# EAGLE design LEDPanel_Dimmer (EAGLE 9.3.2)
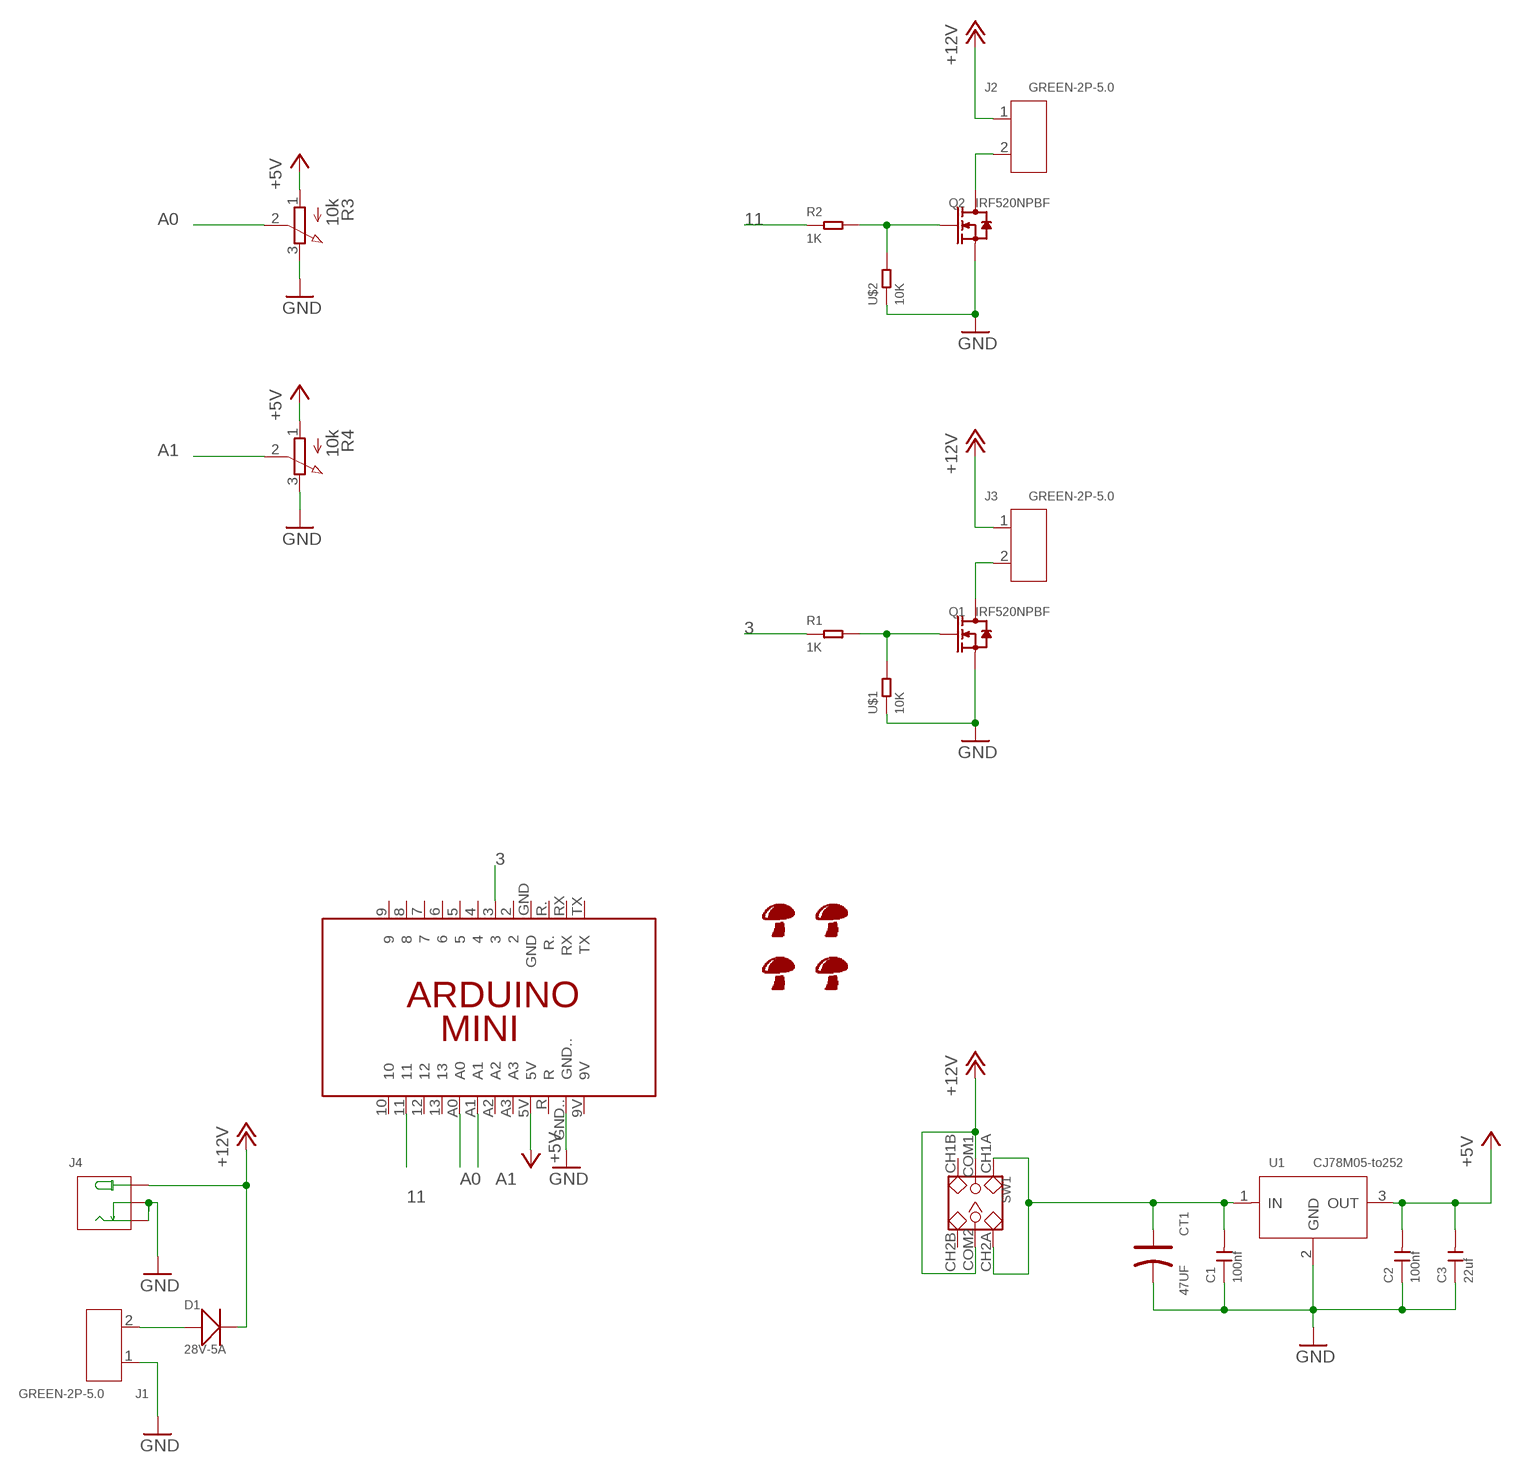
[diagram p0: schematic, sheet 1]

## Parts
C1  100nf  CERAMIC-100NF-50V-10%-X7R(0805)  [C0805]
C2  100nf  CERAMIC-100NF-50V-10%-X7R(0805)  [C0805]
C3  22uf  CERAMIC-22UF-6.3V-20%-X5R(0805)  [C0805]
CT1  47UF  ALUMINUM-SMD-47UF-25V(D6.3-H5.3MM)  [ELECTRO-SMD-C-6MM]
D1  28V-5A  SMD-DIODE-SCHOTTKY-28V-5A(DO-214AA)  [DO-214AA]
J1  GREEN-2P-5.0  SCREW-TERMINAL-GREEN(2P-5.0)  [H2-5.0-10.5X8.0MM]
J2  GREEN-2P-5.0  SCREW-TERMINAL-GREEN(2P-5.0)  [H2-5.0-10.5X8.0MM]
J3  GREEN-2P-5.0  SCREW-TERMINAL-GREEN(2P-5.0)  [H2-5.0-10.5X8.0MM]
J4  JACK-DC-005'DC-005'  [3P-L14.2*W11.0*H9.0MM]
Q1  IRF520NPBF  DIP-MOSFET-N-CH-100V-9.7A-IRF520NPBF(TO-220AB)  [TO-220]
Q2  IRF520NPBF  DIP-MOSFET-N-CH-100V-9.7A-IRF520NPBF(TO-220AB)  [TO-220]
R1  1K  SMD-RES-100R-1%-1/8W(0805)  [R0805]
R2  1K  SMD-RES-100R-1%-1/8W(0805)  [R0805]
R3  10k  3RP/1610N  [3RP/1610N]
R4  10k  3RP/1610N  [3RP/1610N]
SW1  DIP-TOGGLE-SWITCH-2CH-(2X3P-2.54)  [SW6-2.54-9.0X3.5X3.2+2.0MM]
U1  CJ78M05-to252  PMIC-CJ78M05(TO-252)  [TO-252]
U$1  10K  SMD-RES-10K-1%-1/8W(0805)  [R0805]
U$2  10K  SMD-RES-10K-1%-1/8W(0805)  [R0805]
U$3  ARDUINO_MINI_REDUCED  [ARDUINO_MINI_REDUCED]
U$4  SHROOMBOTTOMSILK  [SHROOM_BS]
U$5  SHROOMTOPSILK  [SHROOM_TS]
U$6  SHROOM10MM  [SHROOM10MM]
U$7  SHROOM5MM  [SHROOM]

## Nets
3: R1.1 U$3.3
11: R2.1 U$3.11
+5V: C2.2 C3.2 R3.1(A) R4.1(A) U1.3(OUT) U$3.5V
+12V: D1.- J2.1 J3.1 J4.+ SW1.COM1 SW1.COM2
A0: R3.2(S) U$3.A0
A1: R4.2(S) U$3.A1
GND: C1.1 C2.1 C3.1 CT1.- J1.1 J4.-1(-) J4.-2(CDN) Q1.3(S) Q2.3(S) R3.3(E) R4.3(E) U1.2(GND) U$1.1 U$2.1 U$3.GND..
N$1: D1.+ J1.2
N$2: C1.2 CT1.+ SW1.CH1A SW1.CH2A U1.1(IN)
N$3: Q1.1(G) R1.2 U$1.2
N$4: J3.2 Q1.2(D) Q1.HEAT(D)
N$6: Q2.1(G) R2.2 U$2.2
N$8: J2.2 Q2.2(D) Q2.HEAT(D)
Unconnected: SW1.CH1B SW1.CH2B U$3.2 U$3.4 U$3.5 U$3.6 U$3.7 U$3.8 U$3.9 U$3.9V U$3.10 U$3.12 U$3.13 U$3.A2 U$3.A3 U$3.GND U$3.R U$3.R. U$3.RX U$3.TX

## Library data of the parts
C1 C2 = OPL_Capacitor:CERAMIC-100NF-50V-10%-X7R(0805): 302010165; MPN: CC0805KRX7R9BB104
C3 = OPL_Capacitor:CERAMIC-22UF-6.3V-20%-X5R(0805): 302010171; MPN: CC0805MKX5R5BB226
CT1 = OPL_Capacitor:ALUMINUM-SMD-47UF-25V(D6.3-H5.3MM): 302030059; MPN: CS1E470M-CRE54
D1 = OPL_Discrete_Semiconductor:SMD-DIODE-SCHOTTKY-28V-5A(DO-214AA): 304020021; MPN: SS54B
J1-J3 = OPL_Connector:SCREW-TERMINAL-GREEN(2P-5.0): 320110031
J4 = OPL_Connector:JACK-DC-005: 320120003
Q1 Q2 = OPL_Discrete_Semiconductor:DIP-MOSFET-N-CH-100V-9.7A-IRF520NPBF(TO-220AB): 305030059; MPN: IRF520NPBF
R1 R2 = OPL_Resistor:SMD-RES-100R-1%-1/8W(0805): 301012151; MPN: RC0805JR-071KL
R3 R4 = pot:3RP/1610N: 16mm Potentiometer one level Source: http://www.alphapotentiometers.net/html/16mm_pot_2.html
SW1 = OPL_Switch:DIP-TOGGLE-SWITCH-2CH-(2X3P-2.54): 311010004; MPN: MS-22D18 G2 ROHS
U1 = OPL_IC:PMIC-CJ78M05(TO-252): 310030100; MPN: CJ78M05
U$1 U$2 = OPL_Resistor:SMD-RES-10K-1%-1/8W(0805): 301012152; MPN: RC0805FR-0710KL
U$3 = RobThePyro:ARDUINO_MINI_REDUCED
U$4-U$7 = RobThePyro:SHROOM

## Board
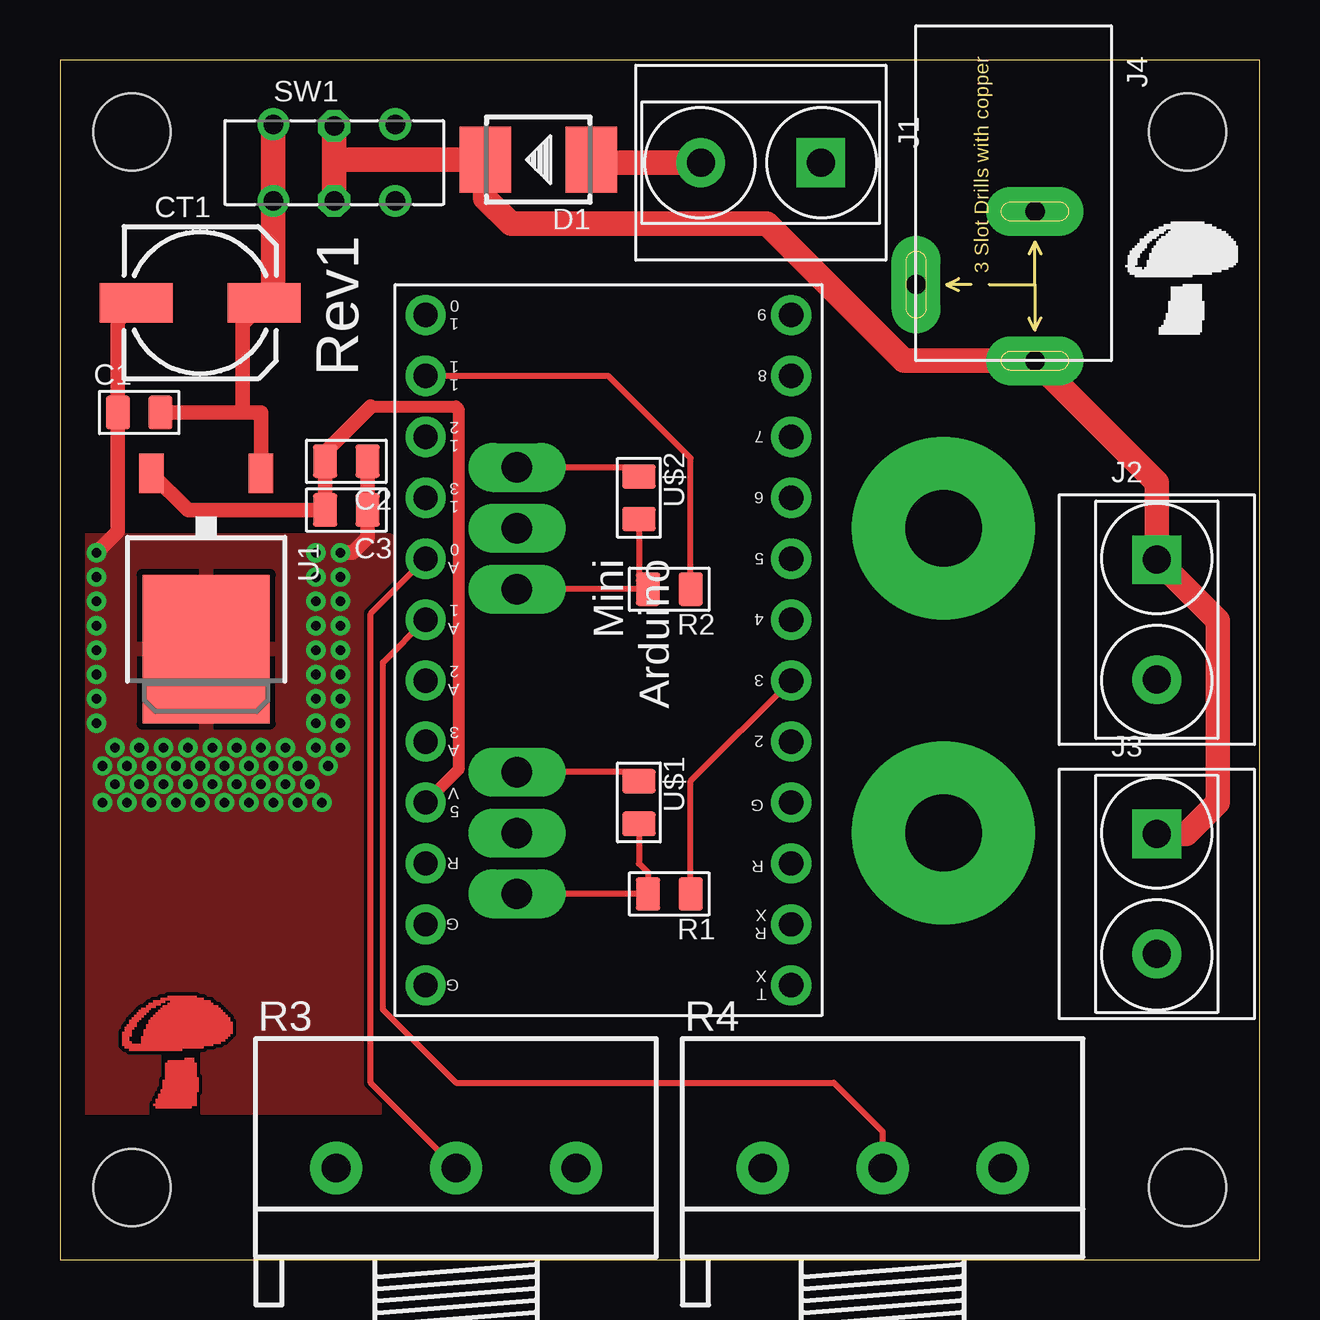
[diagram p1: board, top side]
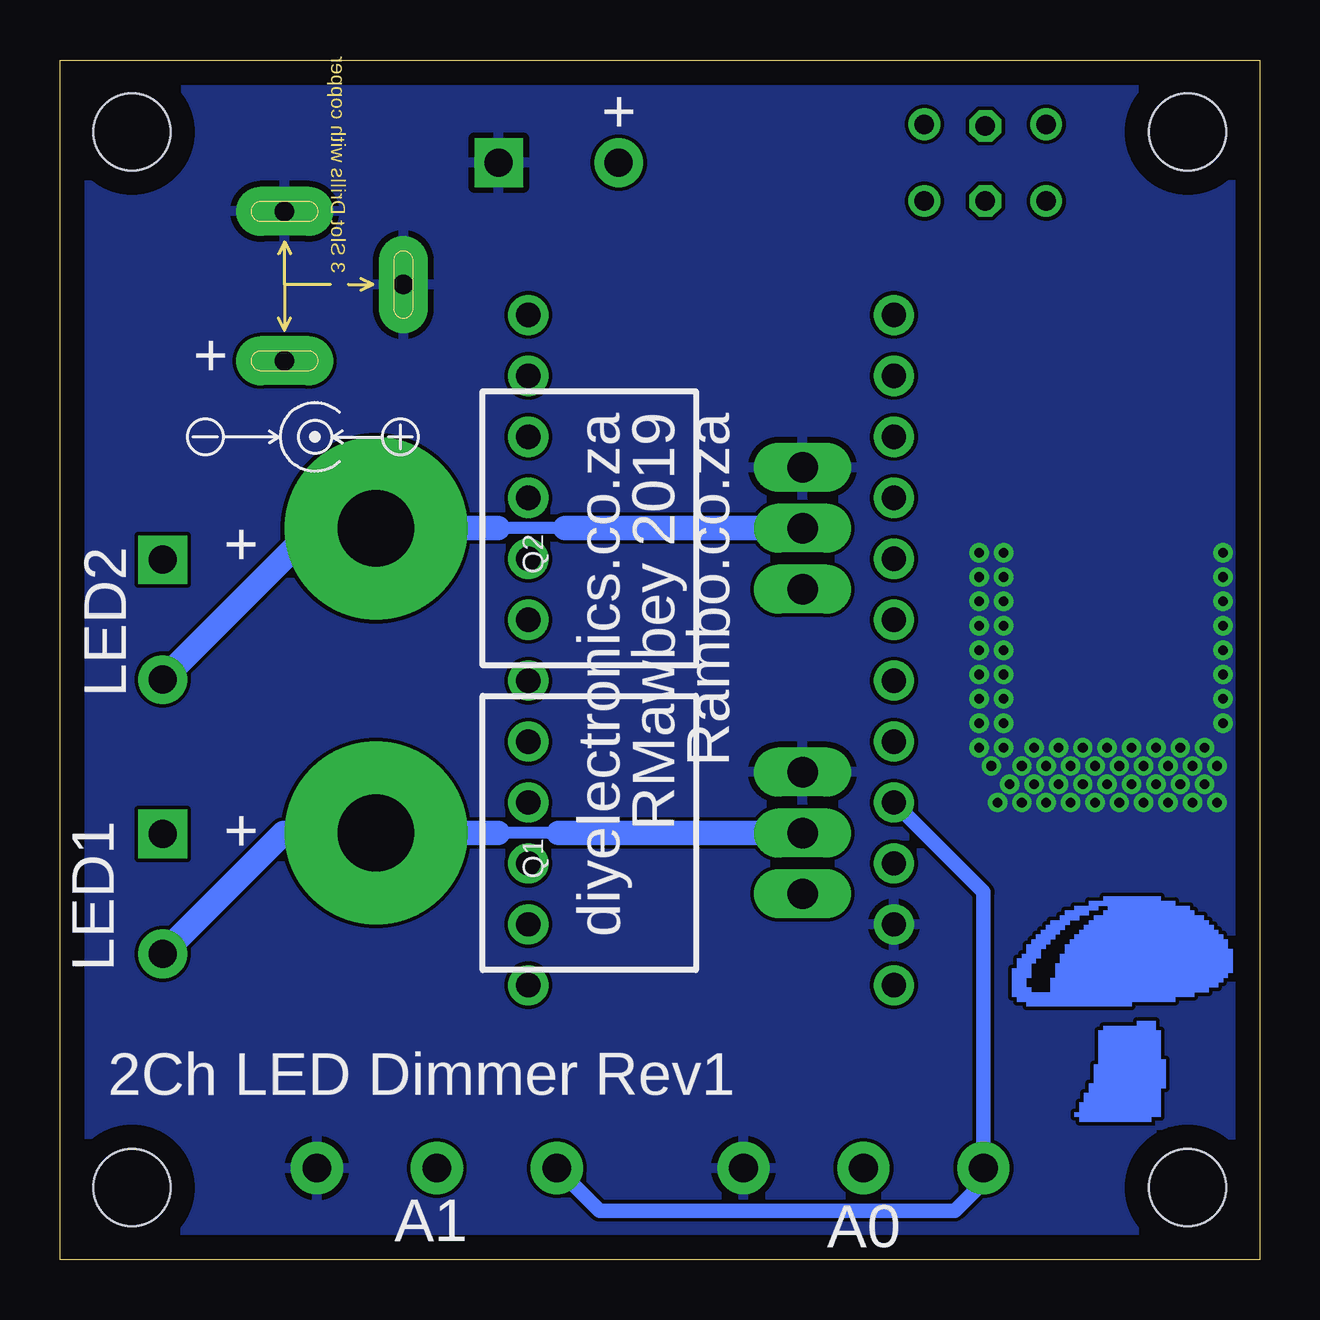
[diagram p2: board, bottom side, seen from below]

Size 50 x 50 mm. Coordinates in mm from the lower left corner, seen from the top.
Outline: 0,0 50,0 50,50 0,50 0,0
Copper layers (1*16): Top 0.035mm / dielectric 1.5mm / Bottom 0.035mm
Design rules "default": minimum track width 6mil, minimum drill 0.35mm, track to track 6mil, track to pad 6mil, pad to pad 6mil, via to via 6mil, smd to smd 6mil, copper to edge 40mil, drill to drill 6mil, minimum pad ring 10mil, minimum via ring 8mil, stop-mask expansion 4mil, vias tented up to drill 0mil, thermal gap 10mil
Holes 3.2 mm at 3,3 47,3 47,47 3,47

### Footprints (pad centres in the part's own frame; a part is rotated, then mirrored left to right if it is on the bottom)
C0805 = smd 1.397 x 1.016: 1 0,0.889; 2 0,-0.889
ELECTRO-SMD-C-6MM = smd 3.048 x 1.651: + 2.667,0; - -2.667,0
DO-214AA = smd 2.159 x 2.743: + -2.21,0; - 2.21,0
H2-5.0-10.5X8.0MM = drill 1.168 pad 2.032 square: 1 0,2.5 | drill 1.168 pad 2.032: 2 0,-2.5
3P-L14.2*W11.0*H9.0MM = drill 0.813 pad 2.032 long: + 3.175,0; -1 -3.048,0; -2 0,-4.953
TO-220 = drill 1.27 pad 2.032 long: 1 -2.54,-11.43; 2 0,-11.43; 3 2.54,-11.43 | drill 3.2 pad 7.62: HEAT 0,6.35
R0805 = smd 1.397 x 1.016: 1 0,0.889; 2 0,-0.889
3RP/1610N = drill 1.2 pad 2.184: 1 -5,0; 2 0,0; 3 5,0
SW6-2.54-9.0X3.5X3.2+2.0MM = drill 0.813 pad 1.27: CH1A -2.54,-1.6; CH1B 2.54,-1.6; CH2A -2.54,1.6; CH2B 2.54,1.6 | drill 0.813 pad 1.27 octagon: COM1 0,-1.6; COM2 0,1.524
TO-252 = smd 1.016 x 1.651: 1 -2.286,-4.826; 3 2.286,-4.826 | smd 5.3 x 6.2: 2 0,2.5
ARDUINO_MINI_REDUCED = drill 1.016 pad 1.676: 2 19.05,16.51; 3 16.51,16.51; 4 13.97,16.51; 5 11.43,16.51; 5V 21.59,1.27; 6 8.89,16.51; 7 6.35,16.51; 8 3.81,16.51; 9 1.27,16.51; 9V 29.21,1.27; 10 1.27,1.27; 11 3.81,1.27; 12 6.35,1.27; 13 8.89,1.27; A0 11.43,1.27; A1 13.97,1.27; A2 16.51,1.27; A3 19.05,1.27; GND 21.59,16.51; GND.. 26.67,1.27; R 24.13,1.27; R. 24.13,16.51; RX 26.67,16.51; TX 29.21,16.51

### Placement (x,y rotation side)
C1  3.3,35.31 90 top
C2  11.94,33.27 270 top
C3  11.94,31.24 270 top
CT1  5.84,39.88 0 top
D1  19.94,45.85 180 top
J1  29.21,45.72 270 top
J2  45.72,26.67 0 top
J3  45.72,15.24 0 top
J4  40.64,40.64 270 top
Q1  30.48,17.78 90 bottom
Q2  30.48,30.48 90 bottom
R1  25.4,15.24 270 top
R2  25.4,27.94 270 top
R3  16.51,3.81 0 top
R4  34.29,3.81 0 top
SW1  11.43,45.72 0 top
U1  6.1,27.94 180 top
U$1  24.13,19.05 0 top
U$2  24.13,31.75 0 top
U$3  13.97,40.64 270 top
U$4  44.45,38.61 0 top
U$5  44.45,38.61 0 top
U$6  10.41,5.84 0 bottom
U$7  2.54,6.35 0 top

### Tracks (layer width: path | path; a pad name or v marks a point on that pad's centre or on a via)
3
  Top 0.254: U$3.3 26.29,19.94 R1.1
11
  Top 0.254: R2.1 26.29,33.4 22.86,36.83 U$3.11
+5V
  Top 0.508: 12.95,35.56 16.51,35.56 16.61,35.46 16.61,20.42 U$3.5V
  Top 0.61: U1.3 5.33,31.24 C3.2 C2.2 11.05,33.66 12.95,35.56
  Bottom 0.61: U$3.5V 11.51,15.32 R3.1 11.51,3.22 12.7,2.03 27.51,2.03 R4.1
+12V
  Top 1.016: 11.43,45.72 SW1.COM2 | 11.43,45.72 11.56,45.85 D1.- 17.73,44.25 18.8,43.18 29.46,43.18 35.18,37.47 J4.+ 45.72,32.38 J2.1 48.26,26.63 48.26,19.05 46.95,17.74 J3.1 | 11.43,45.72 SW1.COM1
A0
  Top 0.254: R3.2 12.95,7.37 12.95,26.92 U$3.A0
A1
  Top 0.254: R4.2 34.29,5.33 32.26,7.37 16.51,7.37 13.46,10.41 13.46,24.89 U$3.A1
GND  (via drill 0.4)
  Top 0.254: U$1.1 23.75,20.32 Q1.3 | U$2.1 23.75,33.02 Q2.3
  Top 0.61: CT1.- 2.41,39.12 C1.1 2.41,30.35 v1.52,29.46 | C2.1 C3.1 12.83,30.1 12.19,29.46 v11.68,29.46
  other vias: 5.33,21.34 6.35,21.34 7.37,21.34 8.38,21.34 9.4,21.34 4.32,21.34 3.3,21.34 2.29,21.34 1.52,22.35 1.52,23.37 1.52,24.38 1.52,25.4 1.52,26.42 1.52,27.43 1.52,28.45 10.67,22.35 10.67,23.37 10.67,24.38 10.67,25.4 10.67,26.42 10.67,27.43 10.67,28.45 10.67,29.46 10.67,21.34 11.68,21.34 11.68,22.35 11.68,23.37 11.68,24.38 11.68,25.4 11.68,26.42 11.68,27.43 11.68,28.45 2.79,20.57 3.81,20.57 4.83,20.57 5.84,20.57 6.86,20.57 7.87,20.57 8.89,20.57 9.91,20.57 1.78,20.57 2.29,19.81 3.3,19.81 4.32,19.81 5.33,19.81 6.35,19.81 7.37,19.81 8.38,19.81 9.4,19.81 10.41,19.81 11.18,20.57 2.79,19.05 1.78,19.05 3.81,19.05 4.83,19.05 5.84,19.05 6.86,19.05 7.87,19.05 8.89,19.05 9.91,19.05 10.92,19.05
  pour Bottom: 0,0 50,0 50,50 0,50
  pour Top: 1.27,29.97 11.68,29.97 13.72,29.97 13.72,6.35 0,6.35 0,29.97
N$1
  Top 1.016: J1.2 22.28,45.72 D1.+
N$2
  Top 0.61: U1.1 8.38,35.31 7.62,35.31 | 7.62,35.31 7.62,38.99 CT1.+ | C1.2 7.62,35.31
  Top 1.016: SW1.CH2A SW1.CH1A 8.89,40.26 CT1.+
N$3
  Top 0.254: Q1.1 R1.2 24.51,16.13 24.13,16.51 U$1.2
N$4
  Bottom 0.508: 29.21,17.78 31.75,17.78
  Bottom 1.016: Q1.2 29.21,17.78 | 31.75,17.78 Q1.HEAT 40.68,17.78 J3.2
N$6
  Top 0.254: Q2.1 R2.2 24.13,28.32 U$2.2
N$8
  Bottom 0.508: 28.96,30.48 31.75,30.48
  Bottom 1.016: Q2.2 28.96,30.48 | 31.75,30.48 Q2.HEAT 39.41,30.48 J2.2

### Text on the board
tNames: Rev1
bNames: + | + | Rambo.co.za | RMawbey 2019 | diyelectronics.co.za | LED2 | + | LED1 | + | 2Ch LED Dimmer Rev1 | A0 | A1